# EAGLE design Total_Schematic_with6820_Rev2 (2) (EAGLE 9.3.0)

## Sheet 1 of 3
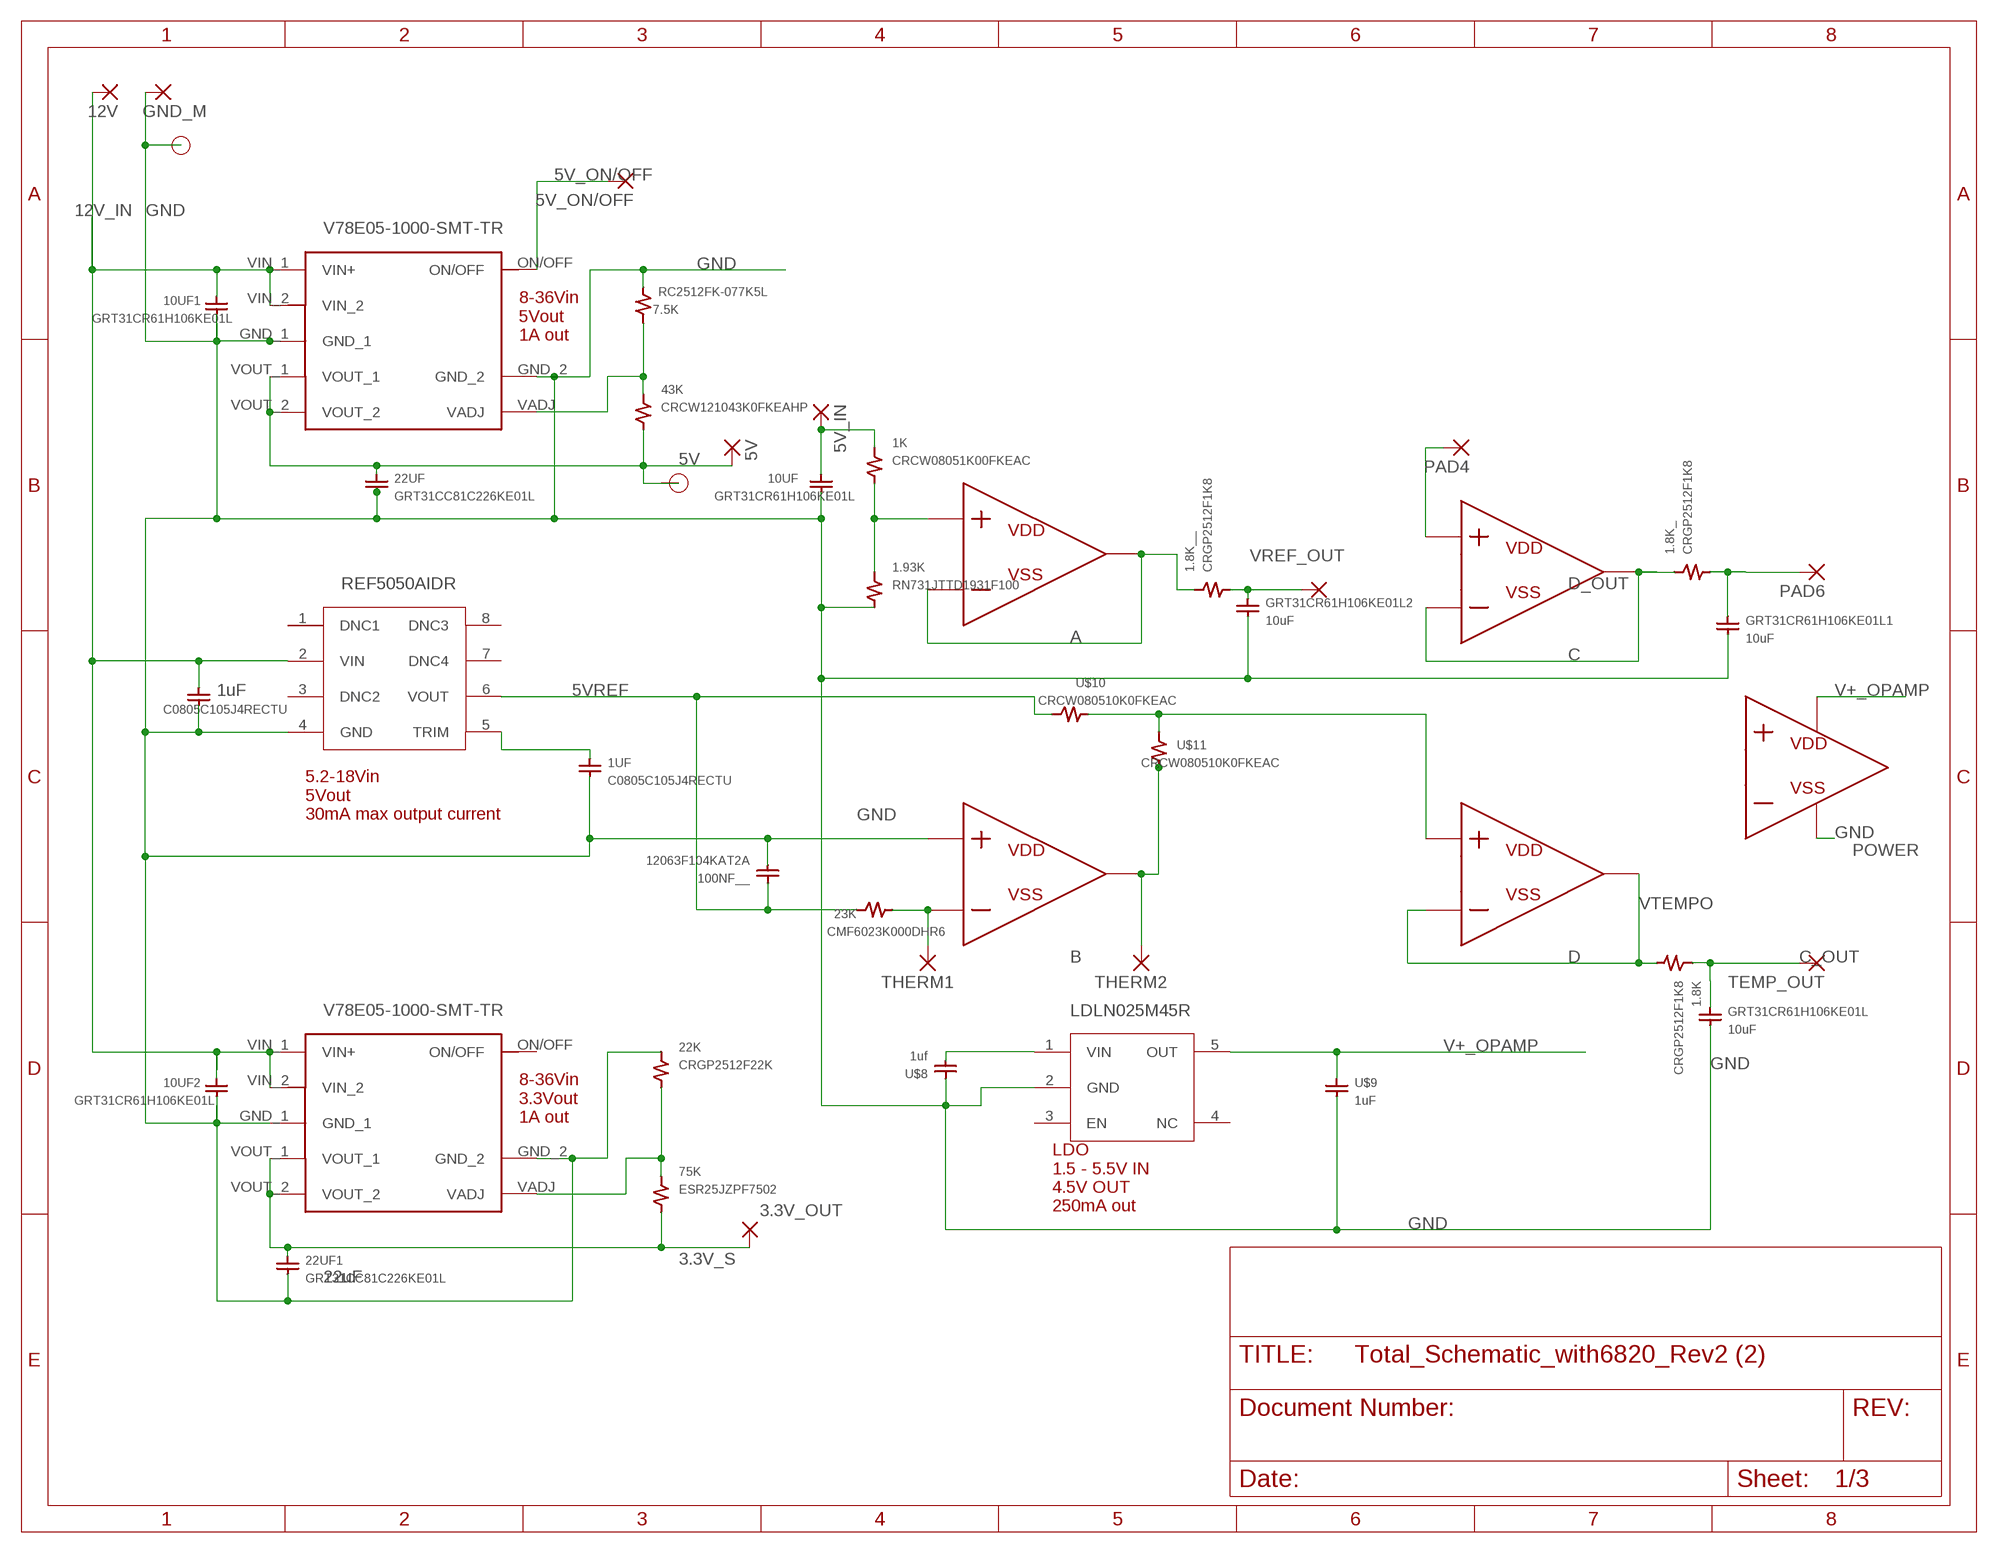
[diagram p0: schematic, sheet 1]

### Parts
1.8K  CRGP2512F1K8  CRGP2512F1K8CRGP2512F1K8  [CRGP2512F1K8]
1.8K_  CRGP2512F1K8  CRGP2512F1K8CRGP2512F1K8  [CRGP2512F1K8]
1.8K__  CRGP2512F1K8  CRGP2512F1K8CRGP2512F1K8  [CRGP2512F1K8]
1.93K  RN731JTTD1931F100  [RN731JTTD1931F100]
1K  CRCW08051K00FKEAC  [CRCW08051K00FKEAC]
1UF  C0805C105J4RECTU  [C0805C105J4RECTU]
3.3V_OUT  2,15/1,0  [2,15/1,0]
5V  WIREPAD2,54/1,0  [2,54/1,0]
5V_2  HEADER_PIN_2.15/1.0  [2,15/1,0]
5V_IN  WIREPAD2,54/1,0  [2,54/1,0]
5V_ON/OFF  2,15/1,0  [2,15/1,0]
7.5K  RC2512FK-077K5L  [RC2512FK-077K5L]
10UF  GRT31CR61H106KE01L  [GRT31CR61H106KE01L]
10UF1  GRT31CR61H106KE01L  [GRT31CR61H106KE01L]
10UF2  GRT31CR61H106KE01L  [GRT31CR61H106KE01L]
12V  WIREPAD2,54/1,0  [2,54/1,0]
22K  CRGP2512F22K  [CRGP2512F22K]
22UF  GRT31CC81C226KE01L  [GRT31CC81C226KE01L]
22UF1  GRT31CC81C226KE01L  [GRT31CC81C226KE01L]
23K  CMF6023K000DHR6  CMF6023K000DHR6CMF6023K000DHR6  [CMF6023K000DHR6]
43K  CRCW121043K0FKEAHP  [CRCW121043K0FKEAHP]
75K  ESR25JZPF7502  [ESR25JZPF7502]
100NF__  12063F104KAT2A  [12063F104KAT2A]
GND2  HEADER_PIN_2.15/1.0  [2,15/1,0]
GND_M  WIREPAD2,54/1,0  [2,54/1,0]
GRT31CR61H106KE01L  10uF  GRT31CR61H106KE01L  [GRT31CR61H106KE01L]
GRT31CR61H106KE01L1  10uF  GRT31CR61H106KE01L  [GRT31CR61H106KE01L]
GRT31CR61H106KE01L2  10uF  GRT31CR61H106KE01L  [GRT31CR61H106KE01L]
PAD4  WIREPAD2,54/1,0  [2,54/1,0]
PAD6  2,15/1,0  [2,15/1,0]
TEMP_OUT  2,15/1,0  [2,15/1,0]
THERM1  WIREPAD2,54/1,0  [2,54/1,0]
THERM2  2,15/1,0  [2,15/1,0]
U$1  V78E05-SMT-TR  [V78E05-1000-SMT-TR]
U$2  V78E03-SMT-TR  [V78E03-1000-SMT-TR]
U$3  REF5050AIDRREF5050AIDR  [SO08]
U$4  LDLN025M45R  [LDLN025M45R]
U$5  C0805C105J4RECTU  [C0805C105J4RECTU]
U$8  1uf  C0805C105J4RECTU  [C0805C105J4RECTU]
U$9  1uF  C0805C105J4RECTU  [C0805C105J4RECTU]
U$10  CRCW080510K0FKEAC  CRCW080510K0FKEACCRCW080510K0FKEAC  [CRCW080510K0FKEAC]
U$11  CRCW080510K0FKEAC  CRCW080510K0FKEACCRCW080510K0FKEAC  [CRCW080510K0FKEAC]
U$12  TSV914AIDR  [TSV914AIDR]
VREF_OUT  2,15/1,0  [2,15/1,0]

### Nets
3.3V_S: 3.3V_OUT.1(P) 22UF1.2 75K.P$1 U$2.VOUT_1 U$2.VOUT_2
5V: 5V.1(P) 5V_2.1 22UF.2 43K.1 U$1.VOUT_1 U$1.VOUT_2
5V_ON/OFF: 5V_ON/OFF.1(P) U$1.ON/OFF
5V_S: 1K.2 5V_IN.1(P) 10UF.2
5VREF: 23K.2 100NF__.2 U$3.6(VOUT) U$10.2
12V_IN: 10UF1.2 10UF2.2 12V.1(P) U$1.VIN_1(VIN+) U$1.VIN_2 U$2.VIN_1(VIN+) U$2.VIN_2 U$3.2(VIN) U$5.2
C_OUT: 1.8K.2 GRT31CR61H106KE01L.2 TEMP_OUT.1(P)
D_OUT: 1.8K_.1 GRT31CR61H106KE01L1.2 PAD6.1(P)
GND: 1.93K.1 1UF.1 7.5K.1 10UF1.1 10UF2.1 10UF.1 22K.P$2 22UF1.1 22UF.1 100NF__.1 GND2.1 GND_M.1(P) GRT31CR61H106KE01L1.1 GRT31CR61H106KE01L2.1 GRT31CR61H106KE01L.1 U$1.GND_1 U$1.GND_2 U$2.GND_1 U$2.GND_2 U$3.4(GND) U$4.2(GND) U$5.1 U$8.2 U$9.1 U$12.+IN_B U$12.V-(GND) ; also sheet 2
N$1: 1.93K.2 1K.1 U$12.+IN_A
N$2: 1.8K_.2 U$12.-IN_C U$12.OUT_C
N$3: 7.5K.2 43K.2 U$1.VADJ
N$4: 1.8K__.1 GRT31CR61H106KE01L2.2 VREF_OUT.1(P)
N$5: 22K.P$1 75K.P$2 U$2.VADJ
N$8: PAD4.1(P) U$12.+IN_C
N$10: 1UF.2 U$3.5(TRIM)
N$14: U$10.1 U$11.2 U$12.+IN_D
N$15: THERM2.1(P) U$11.1 U$12.OUT_B
N$16: 23K.1 THERM1.1(P) U$12.-IN_B
N$17: U$4.1(VIN) U$8.1
V+_OPAMP: U$4.5(OUT) U$9.2 U$12.V+
VREF+: 1.8K__.2 U$12.-IN_A U$12.OUT_A
VTEMPO: 1.8K.1 U$12.-IN_D U$12.OUT_D
Unconnected: U$2.ON/OFF U$3.1(DNC1) U$3.3(DNC2) U$3.7(DNC4) U$3.8(DNC3) U$4.3(EN) U$4.4(NC)

### Notes on the sheet
- 8-36Vin
  5Vout
  1A out
- 1uF
- 5.2-18Vin
  5Vout
  30mA max output current
- 8-36Vin
  3.3Vout
  1A out
- LDO
  1.5 - 5.5V IN
  4.5V OUT
  250mA out
- 22uF

## Sheet 2 of 3
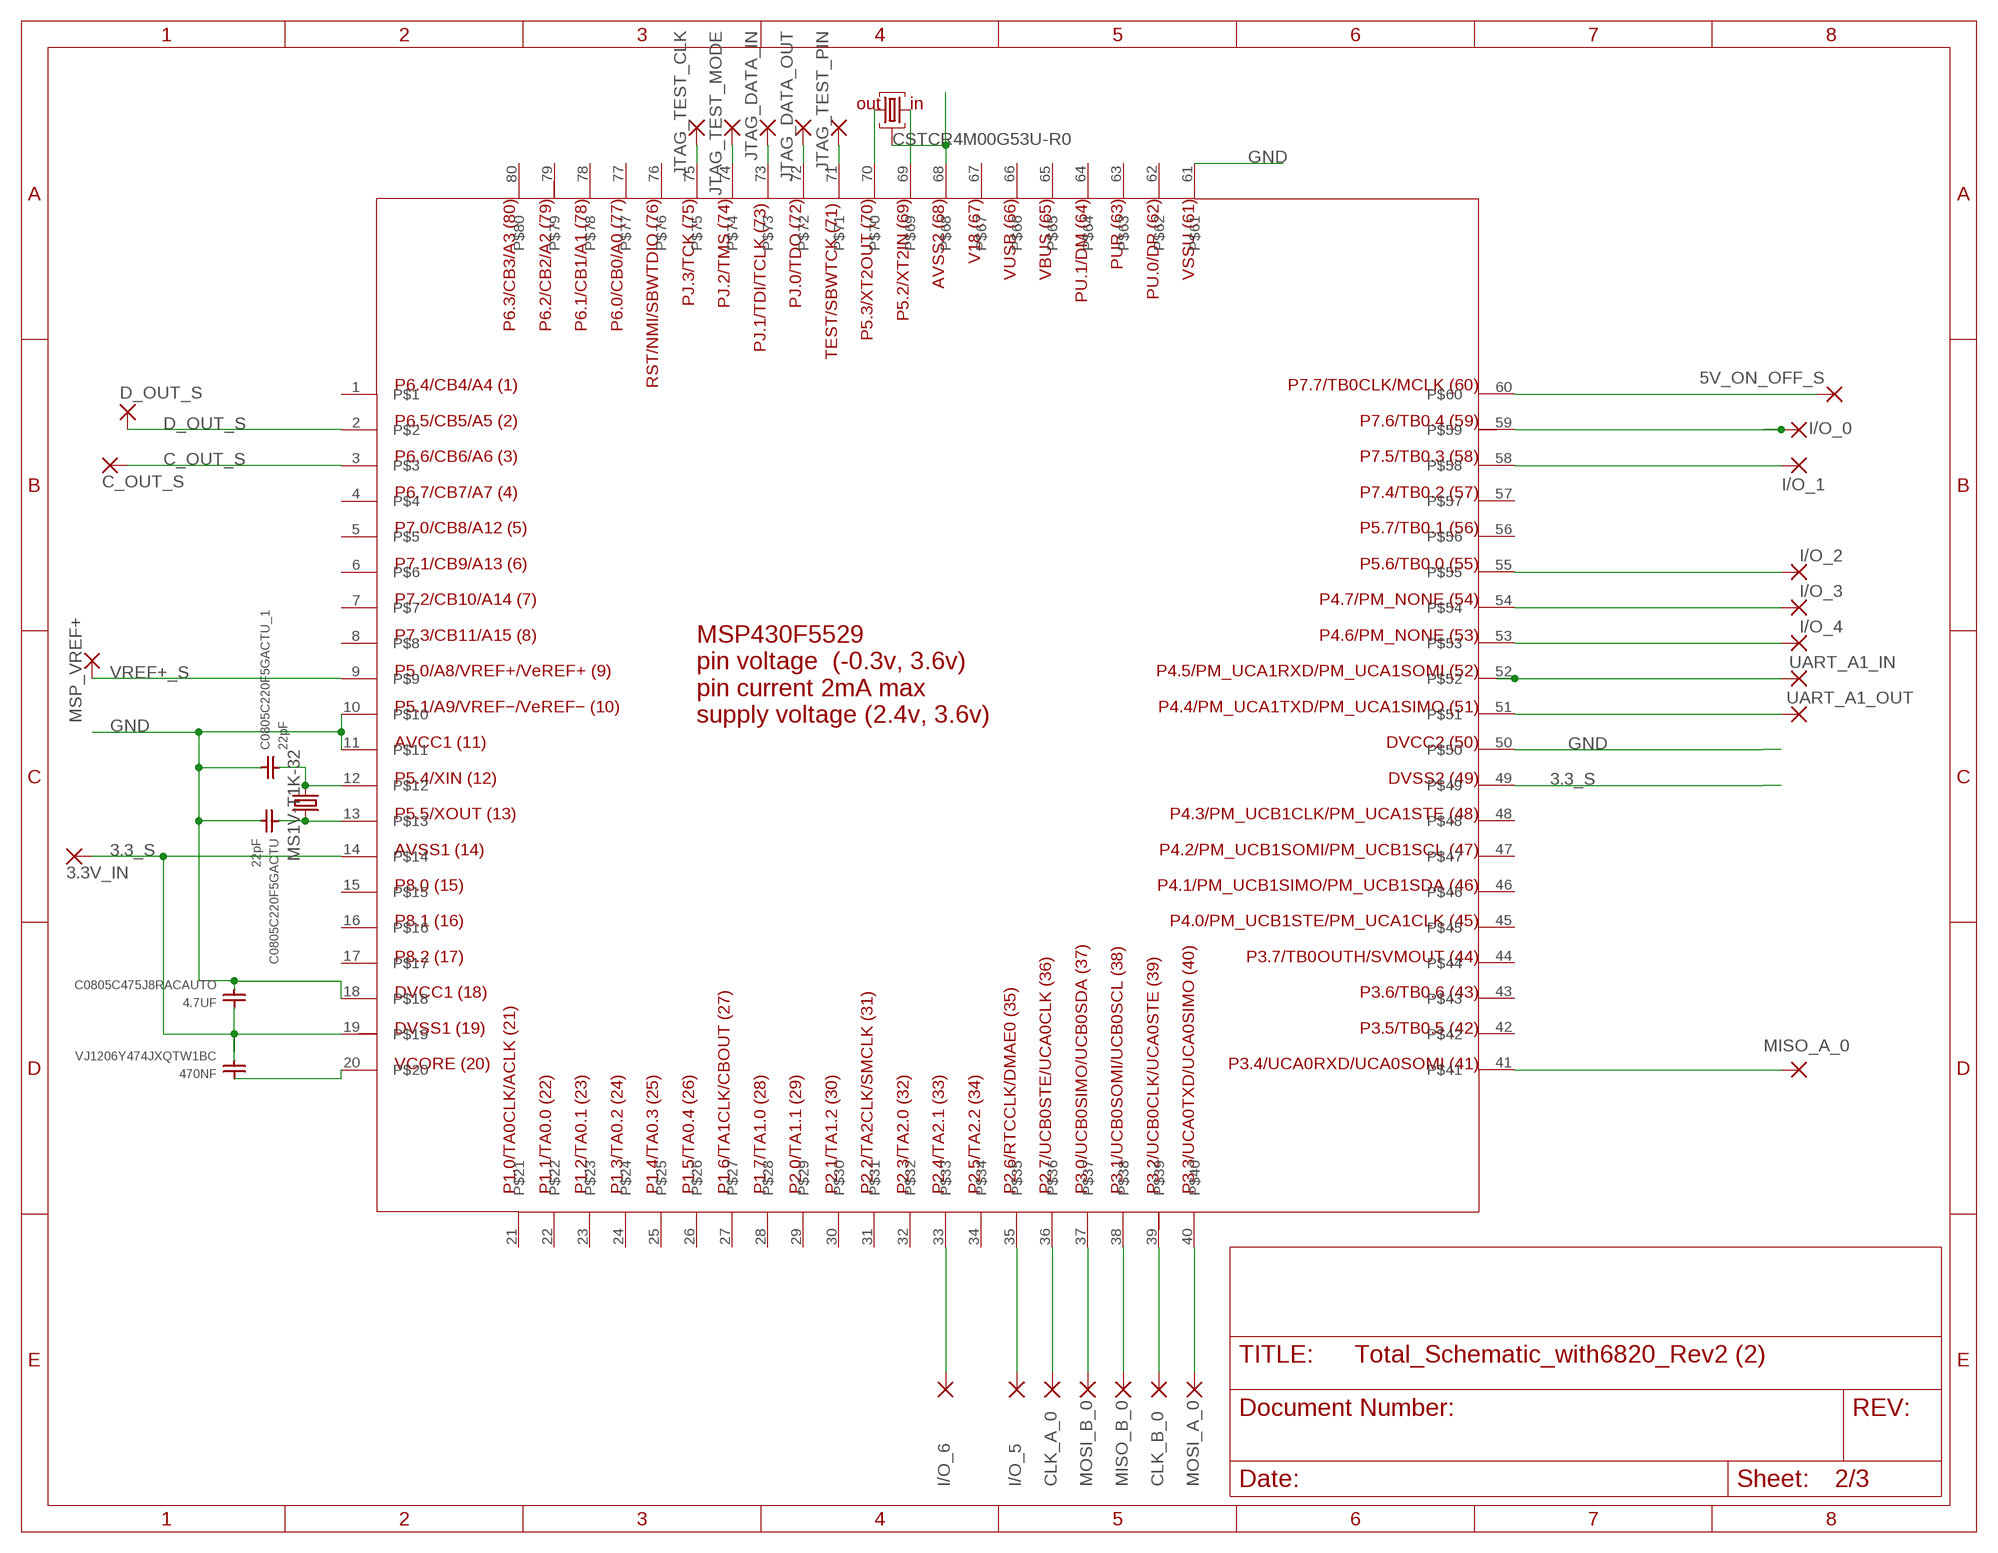
[diagram p1: schematic, sheet 2]

### Parts
3.3V_IN  2,15/1,0  [2,15/1,0]
4.7UF  C0805C475J8RACAUTO  [C0805C475J8RACAUTO]
5V_ON_OFF_S  2,15/1,0  [2,15/1,0]
470NF  VJ1206Y474JXQTW1BC  [VJ1206Y474JXQTW1BC]
C0805C220F5GACTU  22pF  C0805C220F5GACTUC0805C220F5GACTU  [C0805C220F5GACTU]
C0805C220F5GACTU_1  22pF  C0805C220F5GACTUC0805C220F5GACTU  [C0805C220F5GACTU]
C_OUT_S  2,15/1,0  [2,15/1,0]
CLK_A_0  2,15/1,0  [2,15/1,0]
CLK_B_0  2,15/1,0  [2,15/1,0]
D_OUT_S  2,15/1,0  [2,15/1,0]
I/O_0  2,15/1,0  [2,15/1,0]
I/O_1  2,15/1,0  [2,15/1,0]
I/O_2  2,15/1,0  [2,15/1,0]
I/O_3  2,15/1,0  [2,15/1,0]
I/O_4  2,15/1,0  [2,15/1,0]
I/O_5  2,15/1,0  [2,15/1,0]
I/O_6  2,15/1,0  [2,15/1,0]
JTAG_DATA_IN  2,15/1,0  [2,15/1,0]
JTAG_DATA_OUT  2,15/1,0  [2,15/1,0]
JTAG_TEST_CLK  2,15/1,0  [2,15/1,0]
JTAG_TEST_MODE  2,15/1,0  [2,15/1,0]
JTAG_TEST_PIN  2,15/1,0  [2,15/1,0]
MISO_A_0  2,15/1,0  [2,15/1,0]
MISO_B_0  2,15/1,0  [2,15/1,0]
MOSI_A_0  2,15/1,0  [2,15/1,0]
MOSI_B_0  2,15/1,0  [2,15/1,0]
MSP_VREF+  2,15/1,0  [2,15/1,0]
U$15  MS1V-T1K-32  [MS1V-T1K]
U$16  CSTCR4M00G53U-R0  [CSTCR4M00G53U-R0]
U$17  MSP430F5529  [QFP80-841]
UART_A1_IN  2,15/1,0  [2,15/1,0]
UART_A1_OUT  2,15/1,0  [2,15/1,0]

### Nets
3.3_S: 3.3V_IN.1(P) 4.7UF.2 470NF.1 U$17.14 U$17.19 U$17.49
C_OUT_S: C_OUT_S.1(P) U$17.3
D_OUT_S: D_OUT_S.1(P) U$17.2
GND: 4.7UF.1 C0805C220F5GACTU.1 C0805C220F5GACTU_1.2 U$16.GND U$17.10 U$17.11 U$17.18 U$17.50 U$17.61 U$17.68 ; also sheet 1
I/O_1: I/O_0.1(P) U$17.59
MISO_A_0: MISO_A_0.1(P) U$17.41
MOSI_B_0: MOSI_B_0.1(P) U$17.37
N$9: U$16.OUT U$17.70
N$11: U$16.IN U$17.69
N$13: I/O_6.1(P) U$17.33
N$18: I/O_5.1(P) U$17.35
N$19: 470NF.2 U$17.20
N$20: MISO_B_0.1(P) U$17.38
N$21: C0805C220F5GACTU_1.1 U$15.P$2 U$17.12
N$22: C0805C220F5GACTU.2 U$15.P$3 U$17.13
N$23: CLK_B_0.1(P) U$17.39
N$24: MOSI_A_0.1(P) U$17.40
N$25: U$17.51 UART_A1_OUT.1(P)
N$26: I/O_4.1(P) U$17.53
N$27: I/O_3.1(P) U$17.54
N$28: I/O_2.1(P) U$17.55
N$29: I/O_1.1(P) U$17.58
N$30: 5V_ON_OFF_S.1(P) U$17.60
N$31: JTAG_TEST_PIN.1(P) U$17.71
N$32: JTAG_DATA_OUT.1(P) U$17.72
N$33: JTAG_DATA_IN.1(P) U$17.73
N$34: JTAG_TEST_MODE.1(P) U$17.74
N$35: JTAG_TEST_CLK.1(P) U$17.75
N$36: CLK_A_0.1(P) U$17.36
UART_A_IN: U$17.52 UART_A1_IN.1(P)
VREF+_S: MSP_VREF+.1(P) U$17.9
Unconnected: U$17.1 U$17.4 U$17.5 U$17.6 U$17.7 U$17.8 U$17.15 U$17.16 U$17.17 U$17.21 U$17.22 U$17.23 U$17.24 U$17.25 U$17.26 U$17.27 U$17.28 U$17.29 U$17.30 U$17.31 U$17.32 U$17.34 U$17.42 U$17.43 U$17.44 U$17.45 U$17.46 U$17.47 U$17.48 U$17.56 U$17.57 U$17.62 U$17.63 U$17.64 U$17.65 U$17.66 U$17.67 U$17.76 U$17.77 U$17.78 U$17.79 U$17.80

### Notes on the sheet
- CSTCR4M00G53U-R0

## Sheet 3 of 3
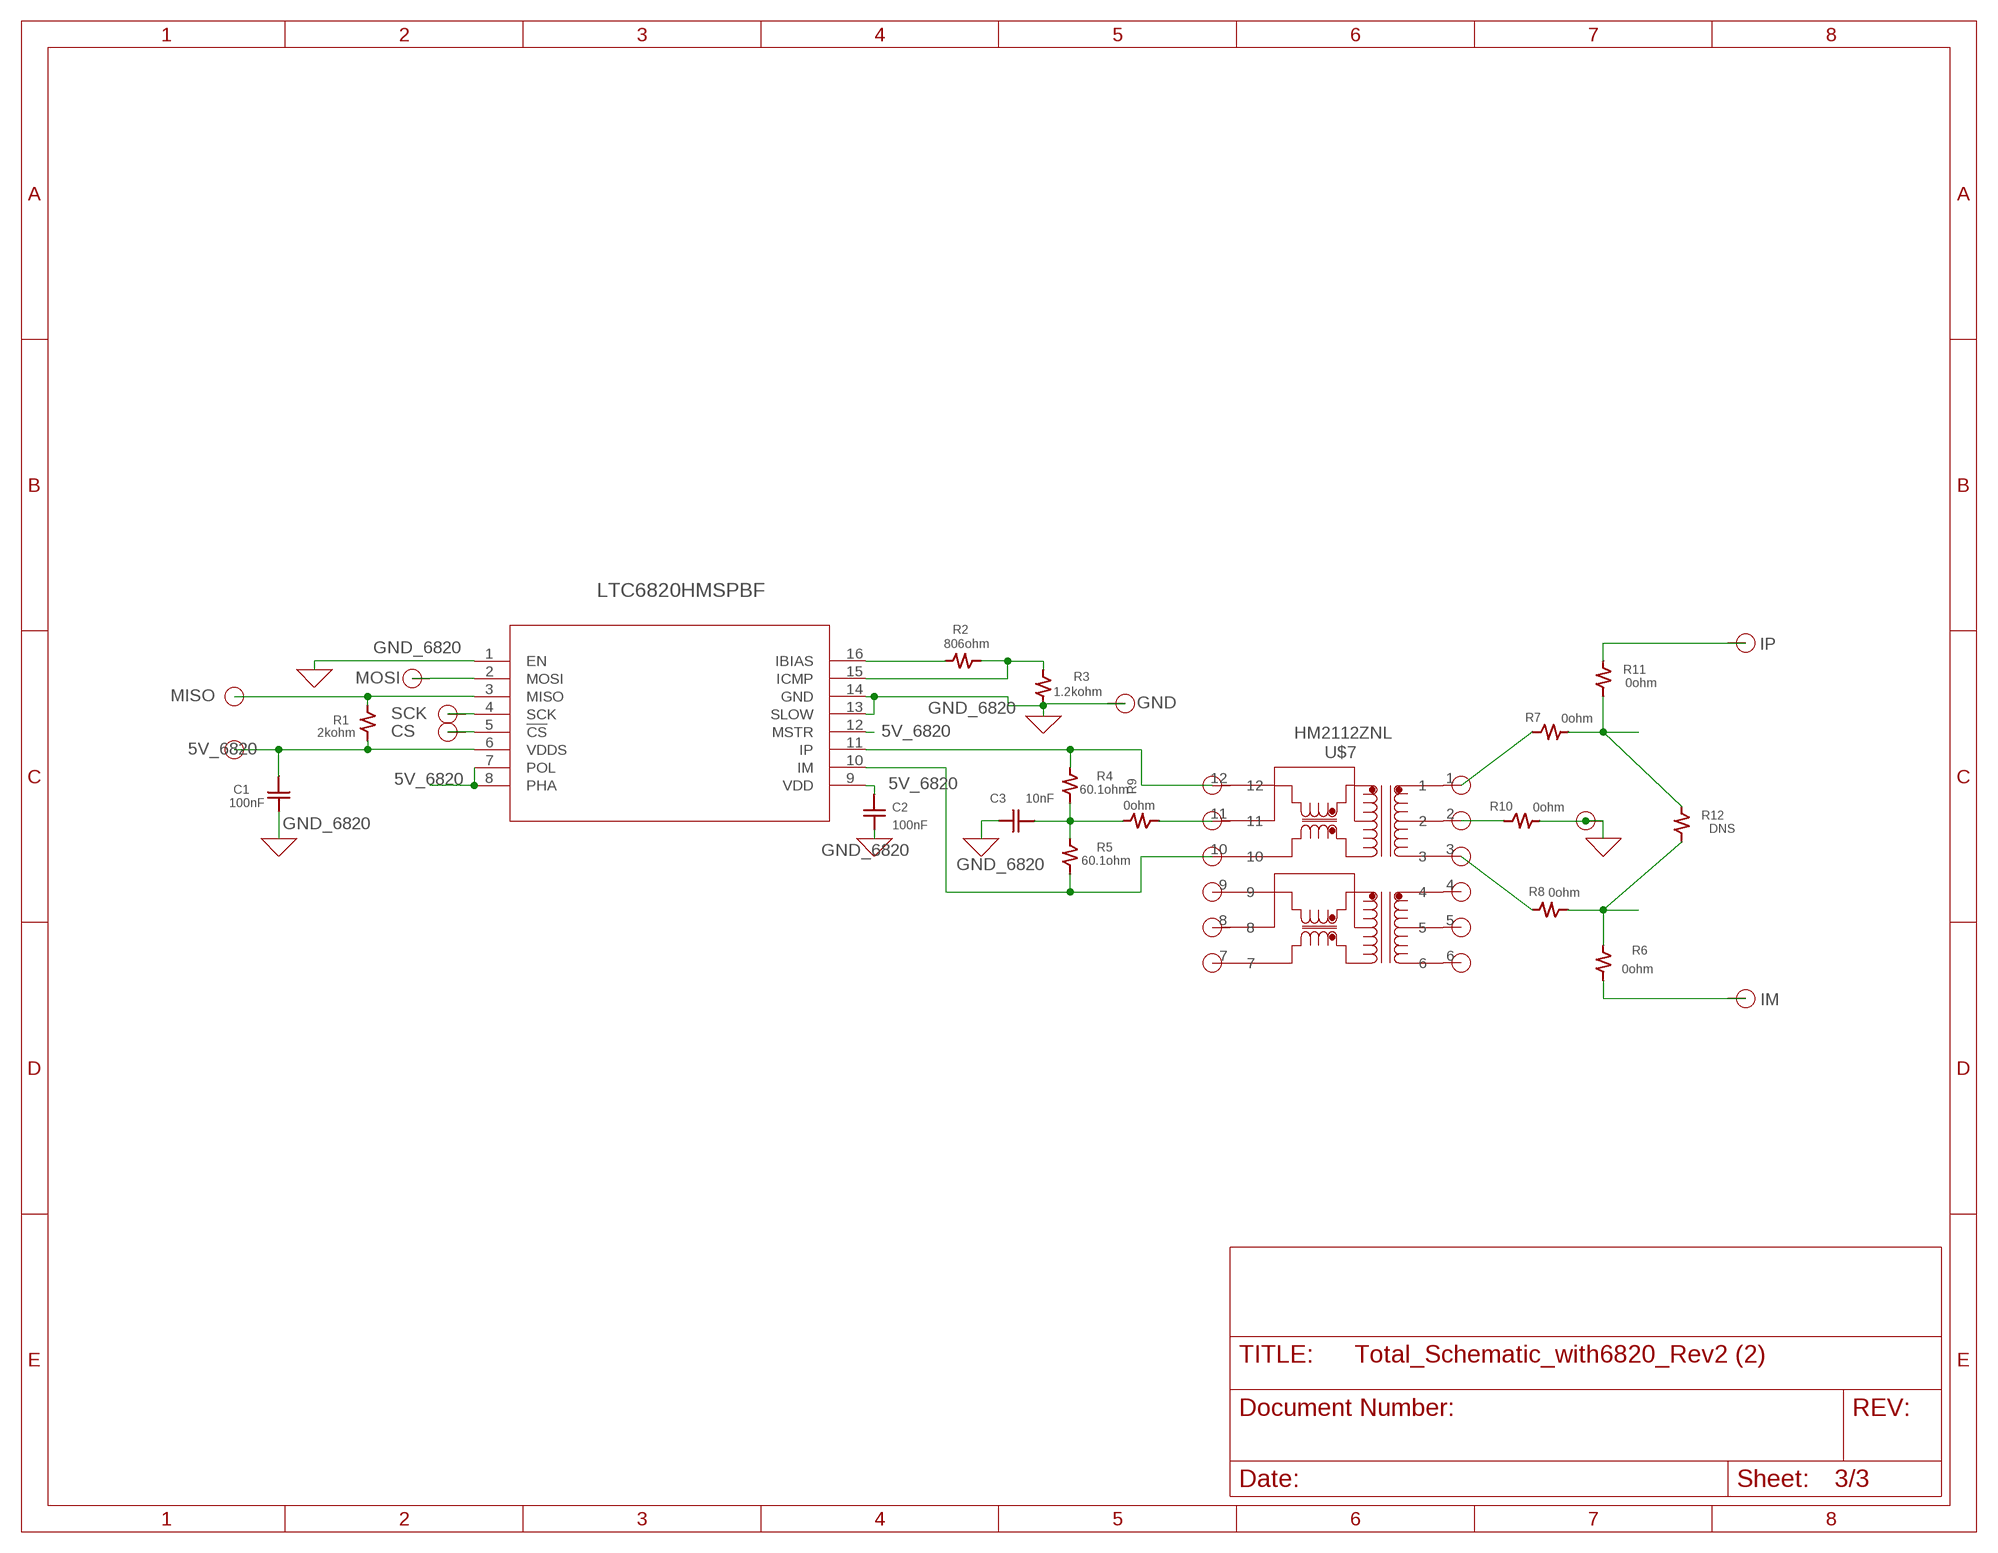
[diagram p2: schematic, sheet 3]

### Parts
5V_6820  HEADER_PIN_2.15/1.0  [2,15/1,0]
C1  100nF  0805_CAPACITOR  [0805_CAPACITOR]
C2  100nF  0805_CAPACITOR  [0805_CAPACITOR]
C3  10nF  0805_CAPACITOR  [0805_CAPACITOR]
CS  HEADER_PIN_2.15/1.0  [2,15/1,0]
GND  HEADER_PIN_2.15/1.0  [2,15/1,0]
GND_6820  HEADER_PIN_2.15/1.0  [2,15/1,0]
IM  HEADER_PIN_2.15/1.0  [2,15/1,0]
IP  HEADER_PIN_2.15/1.0  [2,15/1,0]
MISO  HEADER_PIN_2.15/1.0  [2,15/1,0]
MOSI  HEADER_PIN_2.15/1.0  [2,15/1,0]
R1  2kohm  0805_RESISTOR  [0805_RESISTOR]
R2  806ohm  0805_RESISTOR  [0805_RESISTOR]
R3  1.2kohm  0805_RESISTOR  [0805_RESISTOR]
R4  60.1ohm  0805_RESISTOR  [0805_RESISTOR]
R5  60.1ohm  0805_RESISTOR  [0805_RESISTOR]
R6  0ohm  0805_RESISTOR  [0805_RESISTOR]
R7  0ohm  0805_RESISTOR  [0805_RESISTOR]
R8  0ohm  0805_RESISTOR  [0805_RESISTOR]
R9  0ohm  0805_RESISTOR  [0805_RESISTOR]
R10  0ohm  0805_RESISTOR  [0805_RESISTOR]
R11  0ohm  0805_RESISTOR  [0805_RESISTOR]
R12  DNS  0805_RESISTOR  [0805_RESISTOR]
SCK  HEADER_PIN_2.15/1.0  [2,15/1,0]
U2  LTC6820HMSPBF  [MSOP-16_MS]
U$7  HM2112ZNL  [HM2112ZNL_12SMT]

### Nets
5V_6820: 5V_6820.1 C1.P$2 C2.P$2 R1.P$2 U2.6(VDDS) U2.7(POL) U2.8(PHA) U2.9(VDD) U2.12(MSTR)
CS: CS.1 U2.5(!CS)
GND_6820: C1.P$1 C2.P$1 C3.P$1 GND.1 GND_6820.1 R3.P$2 R10.P$1 U2.1(EN) U2.13(SLOW) U2.14(GND) ; supply symbol labelled GND
IBIAS: R2.P$1 U2.16(IBIAS)
ICMP: R2.P$2 R3.P$1 U2.15(ICMP)
IM: R5.P$2 U2.10(IM) U$7.10
IP: R4.P$1 U2.11(IP) U$7.12
MISO: MISO.1 R1.P$1 U2.3(MISO)
MOSI: MOSI.1 U2.2(MOSI)
N$6: R8.P$1 U$7.3
N$7: C3.P$2 R4.P$2 R5.P$1 R9.P$1
N$12: R7.P$2 U$7.1
N$37: R9.P$2 U$7.11
N$38: R10.P$2 U$7.2
N$40: R6.P$1 R8.P$2 R12.P$2
N$41: R7.P$1 R11.P$2 R12.P$1
N$42: IP.1 R11.P$1
N$43: IM.1 R6.P$2
SCK: SCK.1 U2.4(SCK)
Unconnected: U$7.4 U$7.5 U$7.6 U$7.7 U$7.8 U$7.9

## Library data of the parts
1.8K 1.8K_ 1.8K__ = Library_Capstone:CRGP2512F1K8
1.93K = Library_Capstone:RN731JTTD1931F100
1K = Library_Capstone:CRCW08051K00FKEAC
1UF U$5 U$8 U$9 = Library_Capstone:C0805C105J4RECTU
3.3V_IN 3.3V_OUT 5V_ON/OFF 5V_ON_OFF_S C_OUT_S CLK_A_0 CLK_B_0 D_OUT_S I/O_0 I/O_1-I/O_6 JTAG_DATA_IN JTAG_DATA_OUT JTAG_TEST_CLK JTAG_TEST_MODE JTAG_TEST_PIN MISO_A_0 MISO_B_0 MOSI_A_0 MOSI_B_0 MSP_VREF+ PAD6 TEMP_OUT THERM2 UART_A1_IN UART_A1_OUT VREF_OUT = wirepad:2,15/1,0: THROUGH-HOLE PAD
4.7UF = Library_Capstone:C0805C475J8RACAUTO
5V 5V_IN 12V GND_M PAD4 THERM1 = wirepad:WIREPAD: Wire PAD connect wire on PCB
5V_2 5V_6820 CS GND GND2 GND_6820 IM IP MISO MOSI SCK = Library_Capstone:HEADER_PIN_2.15/1.0
7.5K = Library_Capstone:RC2512FK-077K5L
10UF 10UF1 10UF2 GRT31CR61H106KE01L GRT31CR61H106KE01L1 GRT31CR61H106KE01L2 = Library_Capstone:GRT31CR61H106KE01L
22K = Library_Capstone:CRGP2512F22K
22UF 22UF1 = Library_Capstone:GRT31CC81C226KE01L
23K = Library_Capstone:CMF6023K000DHR6
43K = Library_Capstone:CRCW121043K0FKEAHP
75K = Library_Capstone:ESR25JZPF7502
100NF__ = Library_Capstone:12063F104KAT2A
470NF = Library_Capstone:VJ1206Y474JXQTW1BC
C1-C3 = Library_Capstone:0805_CAPACITOR; MPN: MC0805B104K160CT; OC_NEWARK: 06R3738
C0805C220F5GACTU C0805C220F5GACTU_1 = Library_Capstone:C0805C220F5GACTU
R1 = Library_Capstone:0805_RESISTOR; MPN: ERJ-6ENF2001V; OC_NEWARK: 65T8715
R2 = Library_Capstone:0805_RESISTOR; MF: VISHAY/DALE; MPN: CRCW0805806RFKEA; OC_NEWARK: 53K0501
R3 = Library_Capstone:0805_RESISTOR; MPN: MC0805S8F1201T5E; OC_NEWARK: 04P0558
R4-R12 = Library_Capstone:0805_RESISTOR; MF: BOURNS, INC.; MPN: CR0805-FX-1200GLF; OC_NEWARK: 32K2808
U2 = 6820_MSOP-16_MS-M:LTC6820HMSPBF; MANUFACTURER_PART_NUMBER: LTC6820HMS#PBF; OC_NEWARK: unknown; VENDOR: Linear Technology
U$1 = Library_Capstone:V78E05-SMT-TR
U$2 = Library_Capstone:V78E03-SMT-TR
U$3 = Library_Capstone:REF5050AIDR
U$4 = Library_Capstone:LDLN025M45R
U$7 = Library_Capstone:HM2112ZNL
U$10 U$11 = Library_Capstone:CRCW080510K0FKEAC
U$12 = Library_Capstone:TSV914AIDR
U$15 = Library_Capstone:MS1V-T1K-32
U$16 = Library_Capstone:CSTCR4M00G53U-R0
U$17 = Library_Capstone:MSP430F5529

## Board
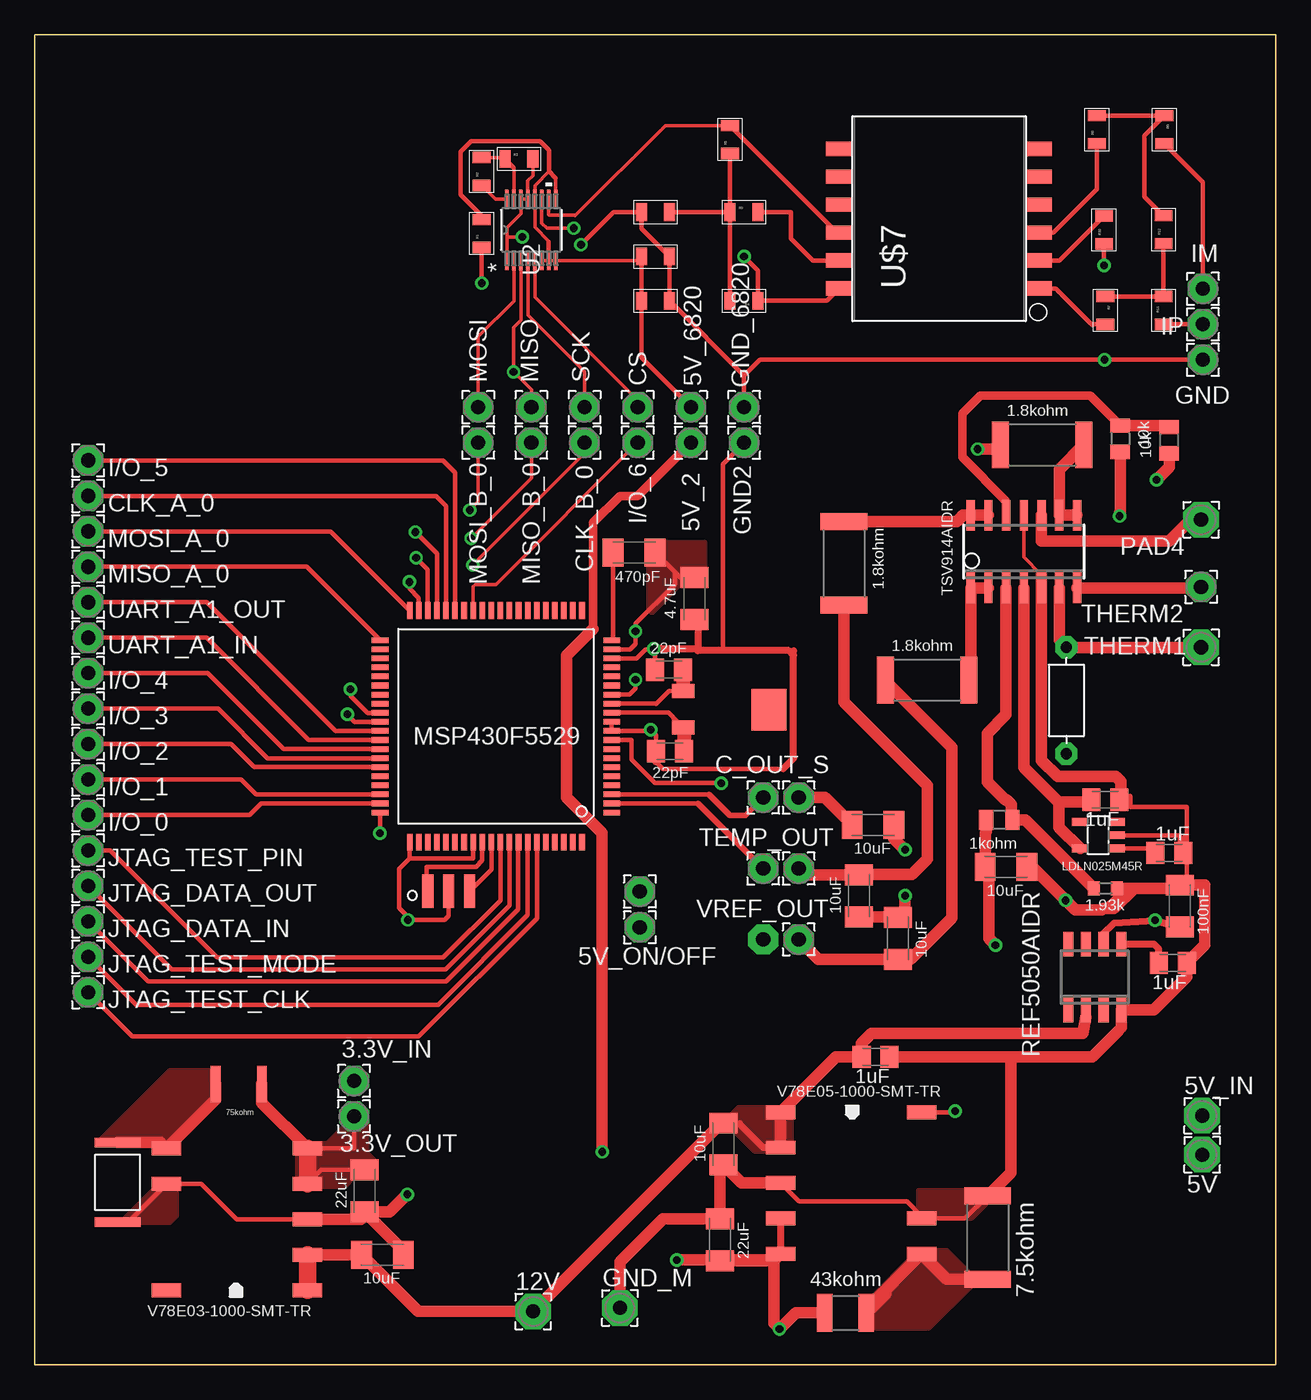
[diagram p3: board, top side]
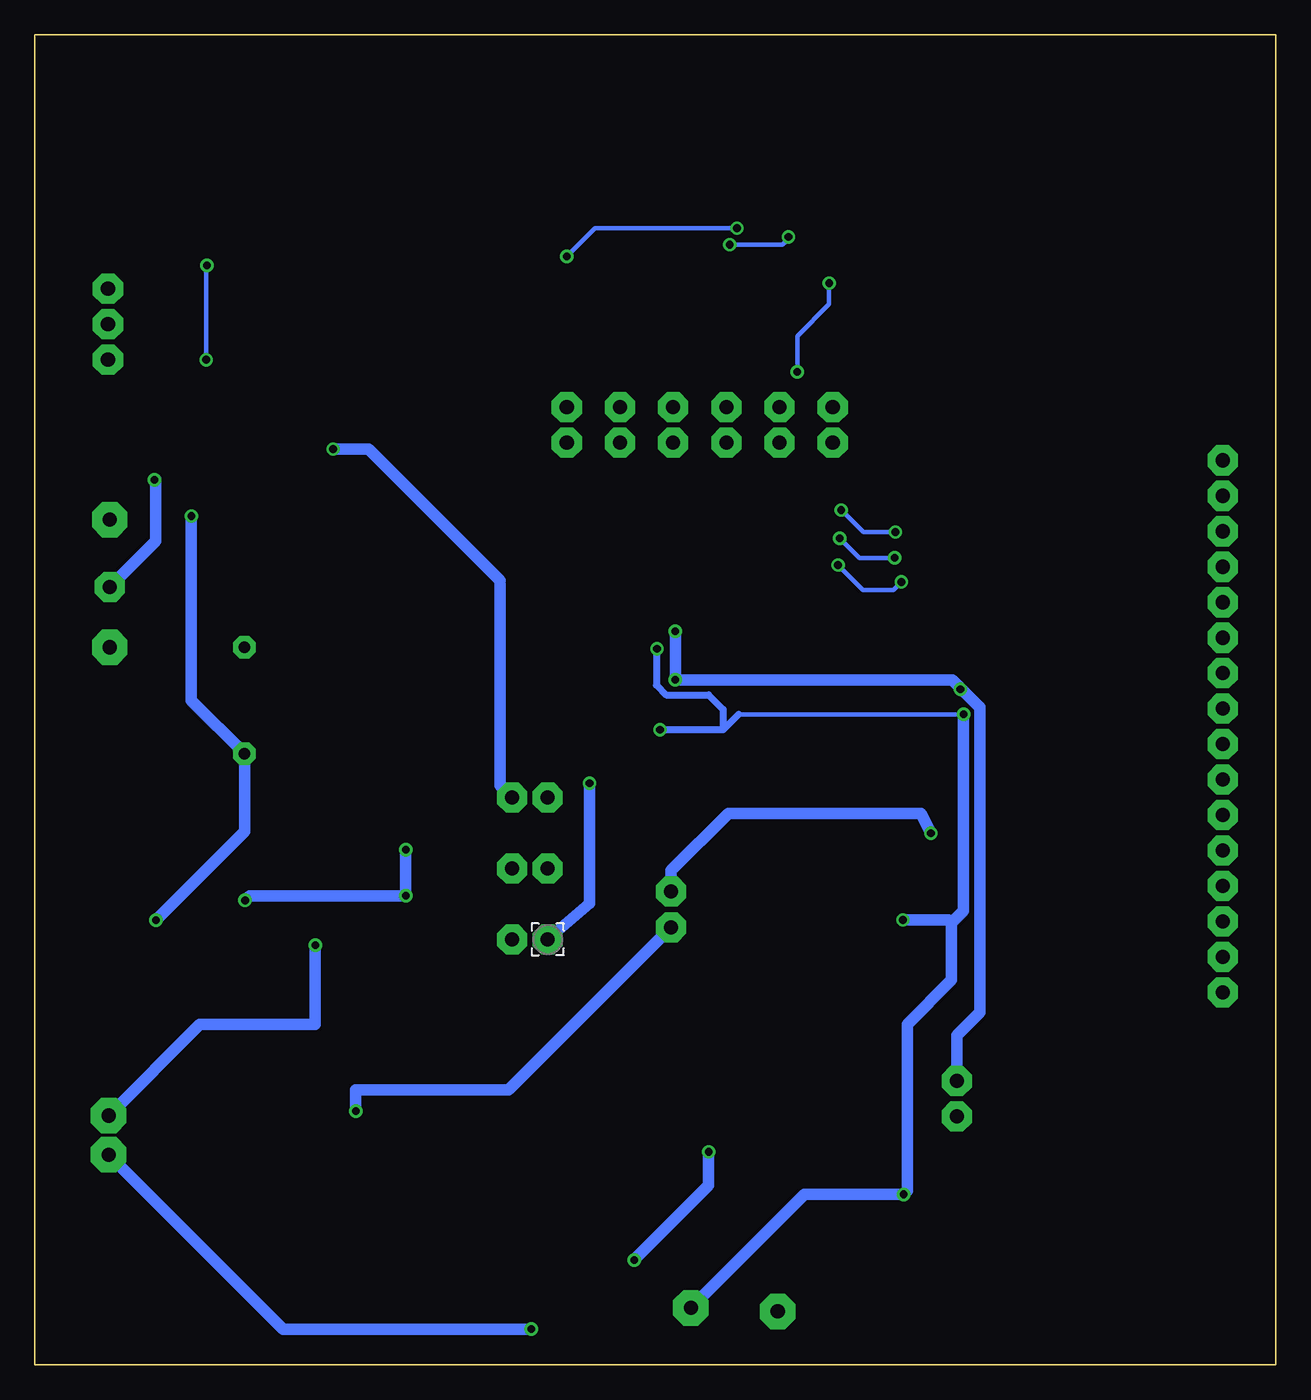
[diagram p4: board, bottom side, seen from below]

Size 88.9 x 95.25 mm. Coordinates in mm from the lower left corner, seen from the top.
Outline: 0,0 0,95.25 88.9,95.25 88.9,0 0,0
Copper layers (1*16): Top 0.035mm / dielectric 1.5mm / Bottom 0.035mm
Design rules "sierraDRC *": minimum track width 8mil, minimum drill 0.35mm, track to track 8mil, track to pad 10mil, pad to pad 8mil, via to via 10mil, smd to smd 8mil, copper to edge 40mil, drill to drill 10mil, minimum pad ring 10mil, minimum via ring 8mil, stop-mask expansion 5mil, vias tented up to drill 0mil, thermal gap 10mil

### Footprints (pad centres in the part's own frame; a part is rotated, then mirrored left to right if it is on the bottom)
CRGP2512F1K8 = smd 1.22 x 3.35: 1 -2.99,0; 2 2.99,0
RN731JTTD1931F100 = smd 0.87 x 0.98: 1 -0.815,0; 2 0.815,0
CRCW08051K00FKEAC = smd 1.02 x 1.4: 1 -0.94,0; 2 0.94,0
C0805C105J4RECTU = smd 1.3 x 1.6: 1 -1,0; 2 1,0
2,15/1,0 = drill 1.016 pad 2.159 octagon: 1 0,0
C0805C475J8RACAUTO = smd 1.5 x 2: 1 -1.5,0; 2 1.5,0
2,54/1,0 = drill 1.016 pad 2.54 octagon: 1 0,0
RC2512FK-077K5L = smd 1.22 x 3.35: 1 -2.99,0; 2 2.99,0
GRT31CR61H106KE01L = smd 1.5 x 2: 1 -1.5,0; 2 1.5,0
CRGP2512F22K = smd 0.7 x 3.3: P$1 2.85,0; P$2 -2.85,0
GRT31CC81C226KE01L = smd 1.5 x 2: 1 -1.5,0; 2 1.5,0
CMF6023K000DHR6 = drill 0.813 pad 1.6 octagon: 1 -3.81,0; 2 3.81,0
CRCW121043K0FKEAHP = smd 1.12 x 2.7: 1 -1.49,0; 2 1.49,0
ESR25JZPF7502 = smd 0.7 x 2.6: P$1 -1.65,-0.01; P$2 1.66,-0.01
12063F104KAT2A = smd 1.5 x 2: 1 -1.5,0; 2 1.5,0
VJ1206Y474JXQTW1BC = smd 1.5 x 2: 1 -1.5,0; 2 1.5,0
0805_CAPACITOR = smd 0.8 x 1.27: P$1 -1,0; P$2 1,0
C0805C220F5GACTU = smd 1.3 x 1.6: 1 -1,0; 2 1,0
0805_RESISTOR = smd 0.8 x 1.27: P$1 -1,0; P$2 1,0
MSOP-16_MS = smd 1.397 x 0.229: 1 -2.184,1.751; 2 -2.184,1.251; 3 -2.184,0.751; 4 -2.184,0.25; 5 -2.184,-0.25; 6 -2.184,-0.751; 7 -2.184,-1.251; 8 -2.184,-1.751; 9 2.184,-1.751; 10 2.184,-1.251; 11 2.184,-0.751; 12 2.184,-0.25; 13 2.184,0.25; 14 2.184,0.751; 15 2.184,1.251; 16 2.184,1.751
V78E05-1000-SMT-TR = smd 1 x 2.1: GND_1 2.54,5.05; GND_2 0,-5.05; ON/OFF -5.08,5.05; VADJ 5.08,5.05; VIN_1 -5.08,-5.05; VIN_2 -2.54,-5.05; VOUT_1 2.54,-5.05; VOUT_2 5.08,-5.05
V78E03-1000-SMT-TR = smd 1 x 2.1: GND_1 2.54,5.05; GND_2 0,-5.05; ON/OFF -5.08,5.05; VADJ 5.08,5.05; VIN_1 -5.08,-5.05; VIN_2 -2.54,-5.05; VOUT_1 2.54,-5.05; VOUT_2 5.08,-5.05
SO08 = smd 0.72 x 1.78: 1 -1.905,-2.35; 2 -0.635,-2.35; 3 0.635,-2.35; 4 1.905,-2.35; 5 1.905,2.35; 6 0.635,2.35; 7 -0.635,2.35; 8 -1.905,2.35
LDLN025M45R = smd 0.55 x 1.2: 1 -0.95,-1.3; 2 0,-1.3; 3 0.95,-1.3; 4 0.95,1.3; 5 -0.95,1.3
HM2112ZNL_12SMT = smd 1.02 x 1.89: 1 0,-7.145; 2 2,-7.145; 3 4,-7.145; 4 6,-7.145; 5 8,-7.145; 6 10,-7.145; 7 10,7.145; 8 8,7.145; 9 6,7.145; 10 4,7.145; 11 2,7.145; 12 0,7.145
CRCW080510K0FKEAC = smd 1.02 x 1.4: 1 -0.94,0; 2 0.94,0
TSV914AIDR = smd 0.6 x 2.2: +IN_A -1.27,-2.6; +IN_B 1.27,-2.6; +IN_C 1.27,2.6; +IN_D -1.27,2.6; -IN_A -2.54,-2.6; -IN_B 2.54,-2.6; -IN_C 2.54,2.6; -IN_D -2.54,2.6; OUT_A -3.81,-2.6; OUT_B 3.81,-2.6; OUT_C 3.81,2.6; OUT_D -3.81,2.6; V+ 0,-2.6; V- 0,2.6
MS1V-T1K = smd 2.5 x 3: P$1 -1.24,0.03 | smd 1.6 x 1: P$2 4.9,1.3; P$3 4.9,-1.3
CSTCR4M00G53U-R0 = smd 0.8 x 2.4: GND 0,0; IN 1.5,0; OUT -1.5,0
QFP80-841 = smd 1.2 x 0.4: 1 -8.3,6.175; 2 -8.3,5.525; 3 -8.3,4.875; 4 -8.3,4.225; 5 -8.3,3.575; 6 -8.3,2.925; 7 -8.3,2.275; 8 -8.3,1.625; 9 -8.3,0.975; 10 -8.3,0.325; 11 -8.3,-0.325; 12 -8.3,-0.975; 13 -8.3,-1.625; 14 -8.3,-2.275; 15 -8.3,-2.925; 16 -8.3,-3.575; 17 -8.3,-4.225; 18 -8.3,-4.875; 19 -8.3,-5.525; 20 -8.3,-6.175; 41 8.3,-6.175; 42 8.3,-5.525; 43 8.3,-4.875; 44 8.3,-4.225; 45 8.3,-3.575; 46 8.3,-2.925; 47 8.3,-2.275; 48 8.3,-1.625; 49 8.3,-0.975; 50 8.3,-0.325; 51 8.3,0.325; 52 8.3,0.975; 53 8.3,1.625; 54 8.3,2.275; 55 8.3,2.925; 56 8.3,3.575; 57 8.3,4.225; 58 8.3,4.875; 59 8.3,5.525; 60 8.3,6.175 | smd 0.4 x 1.2: 21 -6.175,-8.3; 22 -5.525,-8.3; 23 -4.875,-8.3; 24 -4.225,-8.3; 25 -3.575,-8.3; 26 -2.925,-8.3; 27 -2.275,-8.3; 28 -1.625,-8.3; 29 -0.975,-8.3; 30 -0.325,-8.3; 31 0.325,-8.3; 32 0.975,-8.3; 33 1.625,-8.3; 34 2.275,-8.3; 35 2.925,-8.3; 36 3.575,-8.3; 37 4.225,-8.3; 38 4.875,-8.3; 39 5.525,-8.3; 40 6.175,-8.3; 61 6.175,8.3; 62 5.525,8.3; 63 4.875,8.3; 64 4.225,8.3; 65 3.575,8.3; 66 2.925,8.3; 67 2.275,8.3; 68 1.625,8.3; 69 0.975,8.3; 70 0.325,8.3; 71 -0.325,8.3; 72 -0.975,8.3; 73 -1.625,8.3; 74 -2.275,8.3; 75 -2.925,8.3; 76 -3.575,8.3; 77 -4.225,8.3; 78 -4.875,8.3; 79 -5.525,8.3; 80 -6.175,8.3

### Placement (x,y rotation side)
1.8K  57.96,57.4 270 top
1.8K_  72.16,65.89 0 top
1.8K__  63.91,49.05 0 top
1.93K  76.68,34.11 180 top
1K  69.09,39.01 180 top
1UF  81.51,28.78 180 top
3.3V_IN  22.86,20.32 0 top
3.3V_OUT  22.86,17.78 0 top
4.7UF  47.24,54.86 90 top
5V  83.62,15.04 0 top
5V_2  46.99,66.04 180 top
5V_6820  46.99,68.58 90 top
5V_IN  83.62,17.83 0 top
5V_ON/OFF  43.33,31.32 0 top
5V_ON_OFF_S  43.33,33.88 0 top
7.5K  68.25,9.09 270 top
10UF  69.57,35.64 180 top
10UF1  24.89,7.87 180 top
10UF2  49.33,15.8 90 top
12V  35.69,3.81 0 top
22K  5.92,13.06 90 top
22UF  49.07,8.94 270 top
22UF1  23.62,12.45 90 top
23K  73.89,47.57 270 top
43K  58.06,3.71 0 top
75K  14.61,20.09 180 top
100NF__  82.02,32.84 270 top
470NF  42.93,58.17 180 top
C1  44.45,79.38 180 top
C2  44.45,76.2 180 top
C3  44.45,82.55 0 top
C0805C220F5GACTU  45.42,49.78 0 top
C0805C220F5GACTU_1  45.49,43.94 180 top
C_OUT_S  52.17,40.61 0 top
CLK_A_0  3.81,62.23 0 top
CLK_B_0  39.37,66.04 90 top
CS  43.18,68.58 90 top
D_OUT_S  52.17,35.53 0 top
GND  83.67,71.98 180 top
GND2  50.8,66.04 180 top
GND_6820  50.8,68.58 0 top
GND_M  41.91,4.06 0 top
GRT31CR61H106KE01L  59.03,33.58 90 top
GRT31CR61H106KE01L1  60.05,38.66 180 top
GRT31CR61H106KE01L2  61.82,30.53 270 top
I/O_0  3.81,39.37 0 top
I/O_1  3.81,41.91 0 top
I/O_2  3.81,44.45 0 top
I/O_3  3.81,46.99 0 top
I/O_4  3.81,49.53 0 top
I/O_5  3.81,64.77 0 top
I/O_6  43.18,66.04 90 top
IM  83.67,77.06 180 top
IP  83.67,74.52 180 top
JTAG_DATA_IN  3.81,31.75 0 top
JTAG_DATA_OUT  3.81,34.29 0 top
JTAG_TEST_CLK  3.81,26.67 0 top
JTAG_TEST_MODE  3.81,29.21 0 top
JTAG_TEST_PIN  3.81,36.83 0 top
MISO  35.56,68.58 90 top
MISO_A_0  3.81,57.15 0 top
MISO_B_0  35.56,66.04 0 top
MOSI  31.75,68.58 90 top
MOSI_A_0  3.81,59.69 0 top
MOSI_B_0  31.75,66.04 0 top
MSP_VREF+  52.17,30.45 0 bottom
PAD4  83.54,60.53 0 top
PAD6  54.71,40.61 0 top
R1  32,81.03 90 top
R2  32,85.47 90 top
R3  34.67,86.36 0 top
R4  50.8,76.2 180 top
R5  49.78,87.76 90 top
R6  80.9,88.47 270 top
R7  76.68,75.51 270 top
R8  76.07,88.47 90 top
R9  50.8,82.55 0 top
R10  76.58,81.28 90 top
R11  80.85,75.51 90 top
R12  80.85,81.31 90 top
SCK  39.37,68.58 90 top
TEMP_OUT  54.71,35.53 0 top
THERM1  83.54,51.38 0 top
THERM2  83.54,55.7 0 top
U2  35.56,81.28 90 top
U$1  58.47,13 270 top
U$2  14.48,10.41 90 top
U$3  75.92,27.76 0 top
U$4  76.17,37.92 90 top
U$5  60.22,22.05 180 top
U$7  64.77,77.09 90 top
U$8  81.25,36.65 0 top
U$9  76.68,40.46 180 top
U$10  77.75,66.32 270 top
U$11  81.25,66.22 90 top
U$12  70.84,58.24 0 top
U$15  51.33,46.94 180 top
U$16  29.64,33.91 180 top
U$17  33.02,45.72 180 top
UART_A1_IN  3.81,52.07 0 top
UART_A1_OUT  3.81,54.61 0 top
VREF_OUT  54.71,30.45 0 top

### Tracks (layer width: path | path; a pad name or v marks a point on that pad's centre or on a via)
3.3_S  (via drill 0.55 pad 0.9)
  Top 0.305: 470NF.1 45.84,56.76 | 45.84,56.76 46.23,56.36 4.7UF.2 | 45.84,56.76 45.84,55.88 43.03,53.07 v43.03,52.53 43.03,51.63 42.63,51.24 U$17.19 | v22.61,48.39 22.61,47.9 23.85,46.66 24.69,46.66 U$17.49 | v43.03,49.05 43.03,48.44 42.59,47.99 U$17.14
  Bottom 0.305: 23.17,49.05 22.62,48.5 21.35,47.23 21.21,47.09
  Bottom 0.61: 22.62,48.5 22.62,48.4 v22.61,48.39
  Bottom 0.813: 21.21,47.09 21.21,25.22 22.86,23.57 3.3V_IN.1 | 21.35,47.23 23.17,49.05 v43.03,49.05 v43.03,52.53
  pour Top (no thermals): 43.94,58.93 48.01,58.93 48.01,55.88 46.23,55.88 44.2,53.85 43.94,54.1
3.3V_S
  Top 0.305: 3.3V_OUT.1 22.86,15.49 U$2.VOUT_2 19.53,14.81 19.48,14.76 | U$2.VOUT_1 20.52,13.95 22UF1.2
  Top 0.813: 75K.P$1 16.25,18.77 U$2.VOUT_2
  Top 1.27: U$2.VOUT_1 U$2.VOUT_2
  pour Top (no thermals): 19.35,15.85 20.93,15.85 22.83,17.75 23.67,17.75 23.8,17.63 23.8,15.16 24.41,14.55 23.27,13.41 22.83,13.41 22.17,12.75 18.77,12.75 18.77,15.27
5V  (via drill 0.55, 0.55 pad 0.9)
  Top 0.305: U$1.VOUT_2 53.42,7.67 | 49.3,7.67 22UF.2 48.26,7.44
  Top 0.508: U$1.VOUT_1 U$1.VOUT_2 | 49.3,7.67 53.42,7.67
  Top 0.61: 39.99,52.69 39.99,60.31 41.91,62.23 43.18,62.23 5V_2.1
  Top 0.813: v45.97,7.49 48.21,7.49 48.26,7.44 | 22UF.2 52.94,7.44 | 52.94,7.44 U$1.VOUT_2 | v40.64,15.24 40.64,38.1 38.1,40.64 38.1,50.8 39.99,52.69 | 43K.1 54.51,3.71 v53.34,2.54 52.94,2.94 52.94,7.44
  Bottom 0.813: v53.34,2.54 71.12,2.54 5V.1 | v45.97,7.49 40.64,12.83 v40.64,15.24
5V_6820
  Top 0.254: 36.83,85.47 35.81,84.45 U2.12 35.81,81.46 36.81,80.46 36.81,80.45 | 37.31,84.99 U2.9 | U2.6 U2.7 U2.8 43.17,79.1 C1.P$2
  Top 0.305: R1.P$2 32,82.3 30.48,83.82 30.48,86.87 31.24,87.63 36.2,87.63 36.83,87 36.83,85.47 37.31,84.99 | C1.P$2 C2.P$2 43.45,72.12 5V_6820.1 | 36.81,80.45 U2.7
5V_ON/OFF  (via drill 0.55 pad 0.9)
  Top 0.305: U$1.ON/OFF 65.84,18.09 v65.91,18.16
  Bottom 0.813: v65.91,18.16 65.91,19.68 54.97,19.68 5V_ON/OFF.1
5V_S  (via drill 0.55 pad 0.9)
  Top 0.305: 68.34,35.37 10UF.2
  Top 0.813: v68.81,30.05 68.34,30.52 68.34,35.37 | 10UF.2 68.07,38.1 68.15,38.18 1K.2
  Bottom 0.813: 5V_IN.1 77.09,24.36 68.81,24.36 v68.81,30.05
5VREF  (via drill 0.55 pad 0.9)
  Top 0.305: 77.26,31.58 77.32,31.64 | 77.7,60.96 v77.7,60.78
  Top 0.508: 100NF__.2 81.55,31.47 v80.24,31.83 77.32,31.64 | U$3.6 76.56,30.79 76.55,30.79 76.55,30.87 77.26,31.58
  Top 0.813: U$10.2 77.75,61.01 77.7,60.96
  Bottom 0.813: v80.24,31.83 73.89,38.18 23K.2 77.7,47.57 v77.7,60.78
12V_IN
  Top 0.305: U$1.VIN_2 53.34,15.54 53.42,15.63 U$1.VIN_1 | U$1.VIN_1 53.42,17.32 53.4,17.3 | 53.42,17.07 U$1.VIN_1 | 10UF2.2 49.38,17.25 | 75.29,24.89 U$3.2
  Top 0.508: 53.34,15.54 52.18,15.54 50.47,17.25 49.78,17.25 49.38,17.25
  Top 0.813: U$1.VIN_2 U$1.VIN_1 57.38,22.05 U$5.2 59.22,23.02 59.91,23.71 75.07,23.71 75.29,24.89 | U$2.VIN_2 10UF1.2 27.46,3.81 12V.1 49.12,17.25 49.78,17.25
  Top 1.27: U$2.VIN_2 U$2.VIN_1
  pour Top (no thermals): 49.91,17.93 50.39,18.41 54.2,18.41 54.2,15.34 54.13,15.27 52.04,15.27 51.56,15.27 50.01,16.81 50.01,17.83
C_OUT
  Top 0.813: 1.8K.2 57.96,47.45 62.87,42.55 63.93,41.48 63.93,36.23 62.81,35.1 59.05,35.1 GRT31CR61H106KE01L.2 55.17,35.08 TEMP_OUT.1
C_OUT_S
  Top 0.305: U$17.3 48.28,40.84
  Top 0.406: 48.28,40.84 49.78,39.34 50.9,39.34 C_OUT_S.1
CS
  Top 0.254: 43.18,69.09 35.81,76.46 U2.5
  Top 0.305: CS.1 43.18,69.09
D_OUT  (via drill 0.55 pad 0.9)
  Top 0.305: 1.8K_.1 68.87,65.58
  Top 0.813: 68.87,65.58 v67.54,65.58 | GRT31CR61H106KE01L1.2 56.59,40.62 PAD6.1
  Bottom 0.305: 55.59,56.17 55.58,56.16 55.58,55.88
  Bottom 0.813: PAD6.1 55.58,41.48 55.58,55.88 | 55.59,56.17 65,65.58 v67.54,65.58
D_OUT_S
  Top 0.305: U$17.2 47.51,40.2
  Top 0.406: 47.51,40.2 D_OUT_S.1
GND  (via drill 0.55 pad 0.9)
  Top 0.254: U$12.V- 70.84,57.83 72.11,56.56 | 44.05,45.4 v44.12,45.47
  Top 0.305: 82.02,37.43 82.02,36.89 U$8.2 | 82.02,37.43 82.02,37.79 | 82.02,37.79 82.02,37.92 U$4.2 | 82.02,37.79 82.53,37.28 82.53,39.95 78.46,39.95 78.46,40.72 77.94,40.72 U$9.1 | 82.53,34.85 82.53,37.94 82.02,37.43 | 82.53,34.85 82.53,34.37 | 82.53,34.37 82.53,34.11 78.74,34.11 | 7.5K.1 66.63,10.46 U$1.GND_1 63.52,10.62 62.46,11.68 54.74,11.68 U$1.GND_2 | 72.11,55.88 U$12.+IN_B | U$3.4 | 77.64,23.96 75.73,22.05 69.89,22.05 | 100NF__.1 82.53,34.85 | 83.8,34.37 82.53,34.37 | 1.93K.1 77.5,33.62 76.55,32.67 | 71.46,35.64 10UF.1 | 69.91,22.05 69.9,22.06 69.89,22.05 | 47.5,51.14 49.28,51.14 | U$17.68 31.39,36.27 26.85,36.27 | U$17.11 U$17.10 44.05,45.4 | U$16.GND 29.64,32.16 29.34,31.85 v26.72,31.85 26.72,32.08 26.09,32.72 26.09,35.51 26.85,36.27 | U$17.50 22.91,46.05 v22.38,46.58 | 22UF1.1 23.37,10.69 23.37,10.41 | 22K.P$2 6.68,10.21 U$2.GND_1 11.91,12.95 14.45,10.41 U$2.GND_2 | 69.89,22.05 U$5.1 | GND2.1 49.28,64.52 49.28,51.14 | 54.36,51.14 49.28,51.14 | 44.49,43.18 45,42.67 53.59,42.67 | 44.41,51.19 C0805C220F5GACTU.1 | v73.84,33.26 74.54,32.55 | 49.07,14.04 10UF2.1 | C0805C220F5GACTU_1.2 44.49,45.09 v44.12,45.47 | U$17.18 43.1,50.59 43.74,51.23 44.3,51.23 | U$17.61 26.84,36.27 26.85,36.27
  Top 0.508: C0805C220F5GACTU_1.2 44.49,43.18 | 53.59,42.67 54.36,43.43 54.36,50.8 | 54.36,50.8 54.36,51.14 | 54.36,50.8 54.01,51.14 47.5,51.14 47.5,51.27 | 47.5,51.27 v44.34,51.27 | 4.7UF.1 47.5,53.11 47.5,51.27 | v44.34,51.27 44.41,51.19 | 44.3,51.23 v44.34,51.27
  Top 0.813: 23.37,10.41 U$2.GND_2 | GRT31CR61H106KE01L1.1 61.55,37.67 v62.33,36.88 | v62.33,33.58 62.33,32.54 GRT31CR61H106KE01L2.1 61.78,32.08 GRT31CR61H106KE01L.1 | 7.5K.1 69.91,13.75 69.91,22.05 | 69.91,22.05 75.74,22.05 77.64,23.96 77.83,24.14 U$3.4 | U$3.4 80.16,25.41 82.51,27.76 1UF.1 83.8,30.06 83.8,34.37 82.78,34.37 82.53,34.11 | 100NF__.1 81.79,34.11 78.74,34.11 | 78.74,34.11 1.93K.1 | 78.74,34.11 77.3,32.67 76.55,32.67 76.43,32.55 74.54,32.55 71.46,35.64 | U$9.1 77.8,40.58 77.8,41.78 77.44,42.14 73.26,42.14 72.11,43.29 U$12.+IN_B | 72.11,56.56 72.11,55.88 | U$5.1 69.91,22.05 | U$1.GND_2 50.62,13.01 10UF2.1 | GND_M.1 41.91,7.37 44.98,10.44 22UF.1 49.07,14.04 | v26.67,12.19 25.42,10.95 22UF1.1 26.39,8.18 10UF1.1
  Bottom 0.305: 39.6,45.47 39.57,45.49 | 39.06,46 39.57,45.49 | 39.57,45.49 39.6,45.49 39.6,45.72 | v22.38,46.58 38.48,46.58
  Bottom 0.406: 23.24,31.62 23.47,31.85
  Bottom 0.508: 44.37,51.23 44.37,48.67 43.68,47.98 40.64,47.98 39.6,46.94 39.6,45.72 | 38.48,46.58 39.06,46 39.6,45.47 v44.12,45.47
  Bottom 0.813: GND_M.1 33.78,12.19 v26.67,12.19 26.42,12.45 26.42,24.38 23.24,27.56 23.24,31.62 22.38,32.49 v22.38,46.58 | v44.34,51.27 44.37,51.23 | v73.84,33.26 73.52,33.58 v62.33,33.58 v62.33,36.88 | 23.47,31.85 v26.72,31.85
  pour Top (no thermals): 6.1,10.16 9.65,10.16 10.16,10.67 10.16,12.7 8.64,12.7
  pour Top (no thermals): 63.3,10.46 63.3,12.5 68.12,12.5 68.12,11.48 67.11,10.46
GND_6820  (via drill 0.55, 0.55 pad 0.9)
  Top 0.254: 33.81,80.77 33.81,81.44 34.83,82.46 34.83,83.45 U2.14 U2.13 35.3,83.47 35.3,84.79 35.67,85.16 R3.P$2 | 33.81,80.77 U2.1 | v34.92,80.77 33.81,80.77
  Top 0.305: R10.P$1 v76.58,78.74 | GND_6820.1 51,68.38 50.8,68.38 50.8,70.85 | 50.8,70.85 C2.P$1 C1.P$1 43.45,81.38 C3.P$1 41.44,82.55 v39.12,80.22 | 50.8,70.85 51.93,71.98 v76.63,71.98 GND.1
  Bottom 0.305: v39.12,80.22 35.34,80.22 34.8,80.77 v34.92,80.77 | v76.58,78.74 76.63,78.69 v76.63,71.98
I/O_1
  Top 0.305: I/O_0.1 15.39,39.37 16.2,40.18 24.58,40.18 24.59,40.2 U$17.59
IBIAS
  Top 0.254: R2.P$1 33.01,83.46 U2.16
ICMP
  Top 0.254: R2.P$2 33.56,86.47 R3.P$1 | U2.15 34.31,85.72 34.29,85.74
  Top 0.305: 34.29,85.74 R3.P$1
IM
  Top 0.254: R5.P$2 45.16,88.76 38.71,82.31 38.7,82.32 36.85,82.32 | U2.10 36.81,82.37 36.85,82.32 | 36.85,82.32
  Top 0.305: R5.P$2 57.45,81.09 U$7.10
IP  (via drill 0.55 pad 0.9)
  Top 0.254: U2.11 36.31,81.77 36.68,81.41 v38.61,81.41
  Top 0.305: v50.8,79.38 51.8,78.38 R4.P$1 56.74,76.2 U$7.12
  Bottom 0.305: v50.8,79.38 48.77,81.41 v38.61,81.41
MISO  (via drill 0.55 pad 0.9)
  Top 0.254: MISO.1 35.56,69.85 v34.29,71.12 34.29,74.3 34.81,74.81 U2.3
  Top 0.305: v32,77.47 R1.P$1
  Bottom 0.305: v34.29,71.12 34.29,73.66 32,75.95 v32,77.47
MISO_A_0
  Top 0.305: MISO_A_0.1 19.46,57.15 U$17.41
MOSI
  Top 0.254: U2.2 34.31,76.19 31.75,73.64 MOSI.1
MOSI_B_0  (via drill 0.55 pad 0.9)
  Top 0.254: v31.15,61.21 31.75,61.81 MOSI_B_0.1
  Top 0.305: U$17.37 28.8,58.1 v27.25,59.64
  Bottom 0.305: v27.25,59.64 29.54,59.64 31.11,61.21 v31.15,61.21
N$1
  Top 0.813: 1.93K.2 70.97,39.01 1K.1 69.95,39.09 69.95,40.12 69.63,40.45 69.51,40.45 68.22,41.73 68.22,45.21 69.57,46.56 U$12.+IN_A
N$2
  Top 0.305: 73.66,60.84 U$12.-IN_C
  Top 0.813: U$12.OUT_C 73.66,60.84 | U$12.-IN_C 73.38,64.12 1.8K_.2
N$3
  Top 0.813: 60.96,5.08 59.59,3.71 43K.2 59.55,3.96 U$1.VADJ 65.34,6.1 7.5K.2
  pour Top (no thermals): 59.49,4.37 63.3,8.18 65.33,8.18 67.11,6.4 67.11,5.64 64.06,2.59 59.49,2.59
N$4
  Top 0.813: 1.8K__.1 60.92,48.96 65.68,44.2 65.68,32 62.71,29.03 GRT31CR61H106KE01L2.2 56.13,29.03 VREF_OUT.1
N$5
  Top 0.305: 9.02,15.91 U$2.VADJ
  Top 0.813: 75K.P$2 12.95,19.01 U$2.VADJ | 22K.P$1 9.02,15.91
  pour Top (no thermals): 12.7,21.08 9.65,21.08 4.57,16 10.16,16 12.7,18.54
N$6
  Top 0.305: U$7.3 72.96,81.09 76.07,84.2 R8.P$1
N$7
  Top 0.305: R9.P$1 R4.P$2 | C3.P$2 R9.P$1 | R9.P$1 49.8,86.74 R5.P$1
N$8
  Top 0.813: PAD4.1 82.8,60.53 81.28,59 72.11,59 U$12.+IN_C
N$9
  Top 0.305: U$17.70 32.7,35.46 U$16.OUT
N$10
  Top 0.508: U$3.5 80.17,30.11 80.51,29.78 1UF.2
N$11
  Top 0.305: U$17.69 32.05,36.11 31.6,35.66 28.07,35.66 28.07,33.98 U$16.IN
N$12
  Top 0.305: R7.P$2 75.78,74.51 75.74,74.47 73.13,77.09 U$7.1
N$13
  Top 0.254: U$17.33 31.39,55.72 31.56,55.88 33.02,55.88 I/O_6.1
N$14
  Top 0.61: U$12.+IN_D 69.57,61.84 66.42,64.99 66.42,68.11 67.73,69.42 75.59,69.42 U$10.1
  Top 0.813: U$10.1 81.15,67.26 U$11.2
N$15  (via drill 0.55 pad 0.9)
  Top 0.813: THERM2.1 83.48,55.64 U$12.OUT_B | v80.34,63.37 81.25,64.29 U$11.1
  Bottom 0.305: 80.26,63.45 v80.34,63.37
  Bottom 0.813: THERM2.1 80.26,58.98 80.26,63.45
N$16
  Top 0.813: U$12.-IN_B 73.38,51.89 23K.1 THERM1.1
N$17
  Top 0.305: U$4.1 79.94,36.97 U$8.1
N$18
  Top 0.305: U$17.35 30.09,63.91 29.23,64.77 I/O_5.1
N$19
  Top 0.305: 470NF.2 41.43,52 U$17.20
N$20  (via drill 0.55 pad 0.9)
  Top 0.254: v31.24,59.18 35.56,63.5 MISO_B_0.1
  Top 0.305: U$17.38 28.14,56.95 v27.3,57.78
  Bottom 0.305: v27.3,57.78 29.84,57.78 v31.24,59.18
N$21
  Top 0.305: U$15.P$2 46.04,46.04 45.38,46.7 U$17.12
  Top 1.016: U$15.P$2 46.49,45.58 C0805C220F5GACTU_1.1
N$22
  Top 0.305: U$15.P$3 45.41,48.24 44.51,47.34 44.5,47.34 U$17.13
  Top 1.016: C0805C220F5GACTU.2 46.43,49.77 U$15.P$3
N$23  (via drill 0.55 pad 0.9)
  Top 0.254: v31.37,57.28 39.37,65.28 CLK_B_0.1
  Top 0.305: U$17.39 27.5,54.93 26.83,55.6 v26.83,56.06
  Bottom 0.305: v26.83,56.06 27.41,55.48 29.57,55.48 v31.37,57.28
N$24
  Top 0.305: MOSI_A_0.1 21.18,59.69 U$17.40
N$25
  Top 0.305: UART_A1_OUT.1 12.32,54.61 21.54,45.39 24.64,45.39 24.64,45.4 U$17.51
N$26
  Top 0.305: I/O_4.1 12.37,49.53 17.8,44.09 U$17.53
N$27
  Top 0.305: I/O_3.1 13.13,46.99 16.69,43.43 24.6,43.43 24.61,43.45 U$17.54
N$28
  Top 0.305: I/O_2.1 14.07,44.45 15.72,42.8 U$17.55
N$29
  Top 0.305: I/O_1.1 14.78,41.91 15.85,40.84 U$17.58
N$30  (via drill 0.55 pad 0.9)
  Top 0.305: U$17.60 v24.72,38.08 v24.71,38.08
  Bottom 0.813: v24.71,38.08 25.43,39.5 39.22,39.5 43.33,35.38 5V_ON_OFF_S.1
N$31
  Top 0.305: U$17.71 33.34,33.25 29.25,29.16 13.06,29.16 5.38,36.83 JTAG_TEST_PIN.1
N$32
  Top 0.305: U$17.72 34,32.88 29.41,28.3 9.8,28.3 JTAG_DATA_OUT.1
N$33
  Top 0.305: U$17.73 34.65,37.35 34.63,37.34 34.63,32.6 29.45,27.43 8.13,27.43 JTAG_DATA_IN.1
N$34
  Top 0.305: JTAG_TEST_MODE.1 7.24,25.78 28.88,25.78 35.3,32.2 U$17.74
N$35
  Top 0.305: JTAG_TEST_CLK.1 6.99,23.5 27.48,23.5 35.97,31.98 35.97,37.35 35.95,37.37 U$17.75
N$36
  Top 0.305: CLK_A_0.1 28.73,62.23 29.45,61.51 U$17.36
N$37
  Top 0.305: R9.P$2 54.16,82.55 54.16,80.66 55.73,79.09 U$7.11
N$38
  Top 0.305: U$7.2 73.39,79.09 R10.P$2
N$40
  Top 0.305: R12.P$2 79.48,83.68 79.48,88.05 R6.P$1 R8.P$2
N$41
  Top 0.305: R7.P$1 R11.P$2 R12.P$1
N$42
  Top 0.305: IP.1 80.86,74.52 R11.P$1
N$43
  Top 0.305: IM.1 83.67,84.7 R6.P$2
SCK
  Top 0.254: U2.4 35.31,75.18 39.37,71.12 SCK.1
UART_A_IN
  Top 0.305: UART_A1_IN.1 12.29,52.07 19.61,44.76 24.66,44.76 24.67,44.74 U$17.52
V+_OPAMP
  Top 0.813: 73.32,40.3 70.84,42.77 U$12.V+ | 73.32,40.3 73.36,40.25 73.36,38.49 U$4.5 | 73.32,40.3 75.52,40.3 U$9.2
VREF+
  Top 0.305: U$12.OUT_A 67.03,55.45 | 67.03,55.45 67.03,50.8 67.03,49.18 1.8K__.2 | U$12.-IN_A 67.22,55.64 67.03,55.45
  Top 0.813: U$12.-IN_A U$12.OUT_A 67.03,50.8
VREF+_S  (via drill 0.55 pad 0.9)
  Top 0.305: v49.17,41.66 44.41,41.66 44.3,41.76 42.73,43.33 42.73,44.75 41.33,44.75 U$17.9
  Bottom 0.813: v49.17,41.66 49.17,33.02 MSP_VREF+.1
VTEMPO
  Top 0.813: U$12.-IN_D U$12.OUT_D 66.49,60.84 66.32,60.68 66.04,60.39 1.8K.1